# EAGLE design DummyLoad (EAGLE 8.6.3)
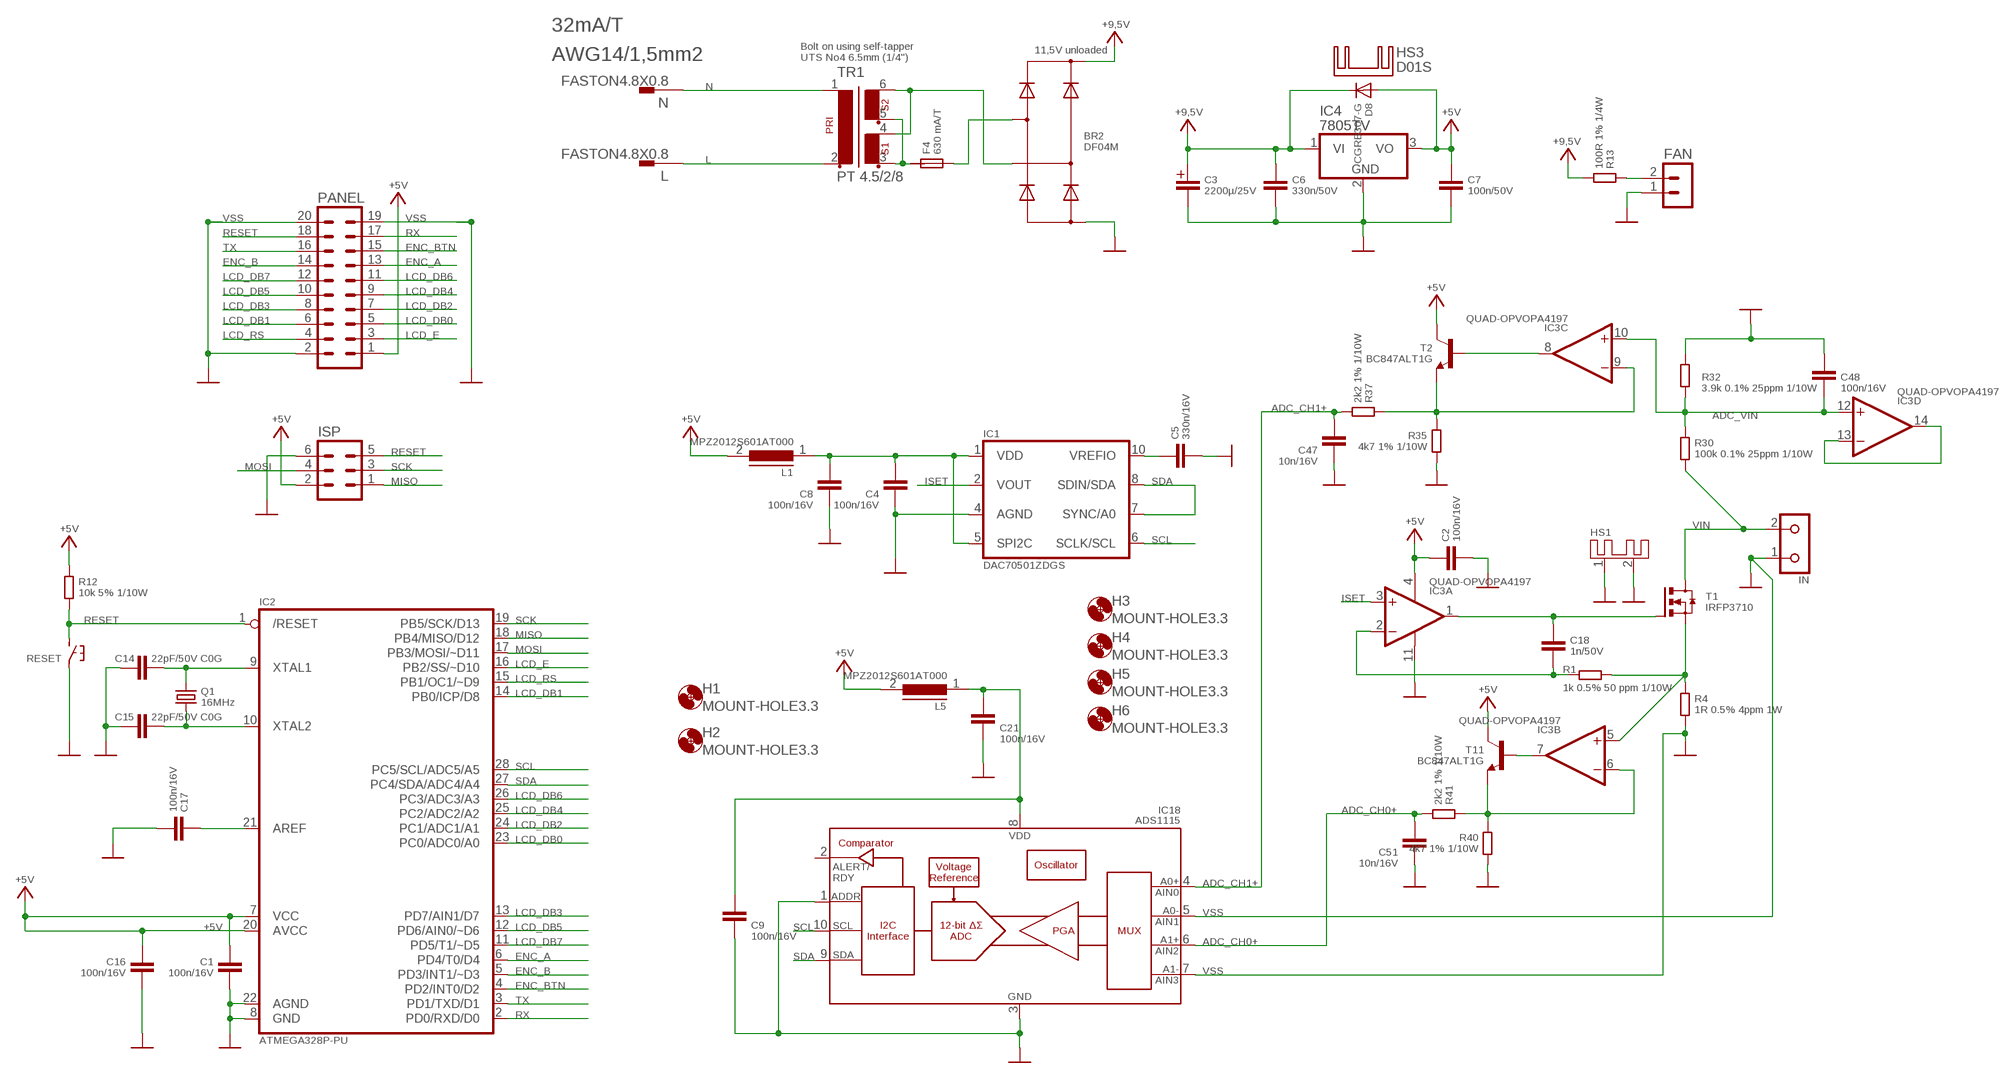
[diagram p0: schematic, sheet 1]

## Parts
BR2  DF04M  BRDIL2  [BR-DIL2]
C1  100n/16V  CC/0805  [0805]
C2  100n/16V  CC/0805  [0805]
C3  2200µ/25V  C+5/12.5  [C+/5/12.5]
C4  100n/16V  CC/0805  [0805]
C5  330n/16V  CC/0805  [0805]
C6  330n/50V  CC/0805  [0805]
C7  100n/50V  CC/0805  [0805]
C8  100n/16V  CC/0805  [0805]
C9  100n/16V  CC/0805  [0805]
C14  22pF/50V C0G  CC/0805  [0805]
C15  22pF/50V C0G  CC/0805  [0805]
C16  100n/16V  CC/0805  [0805]
C17  100n/16V  CC/0805  [0805]
C18  1n/50V  CC/0805  [0805]
C21  100n/16V  CC/0805  [0805]
C47  10n/16V  CC/0805  [0805]
C48  100n/16V  CC/0805  [0805]
C51  10n/16V  CC/0805  [0805]
D8  CGRB307-G  DWIDE  [DO214AA-CGRB307-G]
F4  630 mA/T  F5X20  [F5X20]
FAN  JST-PH-2.0-2P  [JST-PH-2.0-2P]
H1  MOUNT-HOLE3.3  [3,3]
H2  MOUNT-HOLE3.3  [3,3]
H3  MOUNT-HOLE3.3  [3,3]
H4  MOUNT-HOLE3.3  [3,3]
H5  MOUNT-HOLE3.3  [3,3]
H6  MOUNT-HOLE3.3  [3,3]
HS1  HSCR201-50  [CR201-50]
HS3  D01S  [D01S]
IC1  DAC70501ZDGS  DAC70501  [VSSOP10]
IC2  ATMEGA328P-PU  [DIL28]
IC3  QUAD-OPVOPA4197  [SO14]
IC4  7805TV  [TO220V]
IC18  ADS1115  ADS1015VSSOP10  [VSSOP10]
IN  KL2691311500002  [KL2-691311500002]
ISP  ML6  [ML6]
L  FASTON4.8X0.8  [FASTON-4.8X0.8]
L1  MPZ2012S601AT000  L0805  [C0805K]
L5  MPZ2012S601AT000  L0805  [C0805K]
N  FASTON4.8X0.8  [FASTON-4.8X0.8]
PANEL  MA10-2  [MA10-2]
Q1  16MHz  Q5X3.2MM-TXC-7A-SERIES  [Q-5X3.2MM-TXC-7A.SERIES]
R1  1k 0.5% 50 ppm 1/10W  R-SMD0805  [C0805K]
R4  1R 0.5% 4ppm 1W  R-SHUNTVSR  [R-SHUNT-VSR]
R12  10k 5% 1/10W  R-SMD0805  [C0805K]
R13  100R 1% 1/4W  R-SMD0805  [C0805K]
R30  100k 0.1% 25ppm 1/10W  R-SMD0805  [C0805K]
R32  3.9k 0.1% 25ppm 1/10W  R-SMD0805  [C0805K]
R35  4k7 1% 1/10W  R-SMD0805  [C0805K]
R37  2k2 1% 1/10W  R-SMD0805  [C0805K]
R40  4k7 1% 1/10W  R-SMD0805  [C0805K]
R41  2k2 1% 1/10W  R-SMD0805  [C0805K]
RESET  TS1B3F-10XX  [B3F-10XX]
T1  IRFP3710  T-NMOSTO247  [TOP3AV]
T2  BC847ALT1G  T-NPNSOT23-BEC  [SOT23-BEC]
T11  BC847ALT1G  T-NPNSOT23-BEC  [SOT23-BEC]
TR1  PT 4.5/2/8  PT4,5/2/..  [PT/4,5/2/..]

## Nets
+5V: C1.1 C2.1 C7.1 C16.1 D8.A IC2.7(VCC) IC2.20(AVCC) IC3.4(PWR:V+) IC4.3(VO) ISP.2 L1.2 L5.2 PANEL.1 R12.1 T2.C T11.C
+9,5V: BR2.DC+ C3.+ C6.1 D8.C IC4.1(VI) R13.2
ADC_CH0+: C51.1 IC18.6(AIN2) R41.2
ADC_CH1+: C47.1 IC18.4(AIN0) R37.2
ADC_VIN: C48.2 IC3.10(C:+IN) IC3.12(D:+IN) R30.1 R32.2
ENC_A: IC2.6(PD4/T0/D4) PANEL.13
ENC_B: IC2.5(PD3/INT1/~D3) PANEL.14
ENC_BTN: IC2.4(PD2/INT0/D2) PANEL.15
ISET: IC1.2(VOUT) IC3.3(A:+IN)
L: L.A1 L.A2 TR1.2
LCD_DB0: IC2.23(PC0/ADC0/A0) PANEL.5
LCD_DB1: IC2.14(PB0/ICP/D8) PANEL.6
LCD_DB2: IC2.24(PC1/ADC1/A1) PANEL.7
LCD_DB3: IC2.13(PD7/AIN1/D7) PANEL.8
LCD_DB4: IC2.25(PC2/ADC2/A2) PANEL.9
LCD_DB5: IC2.12(PD6/AIN0/~D6) PANEL.10
LCD_DB6: IC2.26(PC3/ADC3/A3) PANEL.11
LCD_DB7: IC2.11(PD5/T1/~D5) PANEL.12
LCD_E: IC2.16(PB2/SS/~D10) PANEL.3
LCD_RS: IC2.15(PB1/OC1/~D9) PANEL.4
MISO: IC2.18(PB4/MISO/D12) ISP.1
MOSI: IC2.17(PB3/MOSI/~D11) ISP.4
N: N.A1 N.A2 TR1.1
N$1: C18.1 IC3.1(A:OUT) T1.B(G)
N$2: IC3.7(B:OUT) T11.B
N$3: C17.1 IC2.21(AREF)
N$4: C18.2 IC3.2(A:-IN) R1.2
N$5: IC3.5(B:+IN) R1.1 R4.1 T1.E(S)
N$6: C9.1 C21.1 IC18.8(VDD) L5.1
N$7: C5.1 IC1.10(VREFIO)
N$8: IC3.8(C:OUT) T2.B
N$9: IC3.13(D:-IN) IC3.14(D:OUT)
N$14: C14.2 IC2.9(XTAL1) Q1.2
N$15: C15.2 IC2.10(XTAL2) Q1.1
N$27: BR2.AC1 F4.3 F4.4
N$33: F4.1 F4.2 TR1.3 TR1.5
N$34: BR2.AC2 TR1.4 TR1.6
N$35: FAN.2 R13.1
N$41: IC3.9(C:-IN) R35.1 R37.1 T2.E
N$45: IC3.6(B:-IN) R40.1 R41.1 T11.E
RESET: IC2.1(/RESET) ISP.5 PANEL.18 R12.2 RESET.3
RX: IC2.2(PD0/RXD/D0) PANEL.17
SCK: IC2.19(PB5/SCK/D13) ISP.3
SCL: IC1.6(SCLK/SCL) IC2.28(PC5/SCL/ADC5/A5) IC18.10(SCL)
SDA: IC1.7(SYNC/A0) IC1.8(SDIN/SDA) IC2.27(PC4/SDA/ADC4/A4) IC18.9(SDA)
TX: IC2.3(PD1/TXD/D1) PANEL.16
VDD: C4.1 C8.1 IC1.1(VDD) IC1.5(SPI2C) L1.1
VIN: IN.2 R30.2 T1.C(D)
VSS: BR2.DC- C1.2 C2.2 C3.- C4.2 C5.2 C6.2 C7.2 C8.2 C9.2 C14.1 C15.1 C16.2 C17.2 C21.2 C47.2 C48.1 C51.2 FAN.1 HS1.1 HS1.2 IC1.4(AGND) IC2.8(GND) IC2.22(AGND) IC3.11(PWR:V-) IC4.2(GND) IC18.1(ADDR) IC18.3(VSS) IC18.5(AIN1) IC18.7(AIN3) IN.1 ISP.6 PANEL.2 PANEL.19 PANEL.20 R4.2 R32.1 R35.2 R40.2 RESET.1
Unconnected: IC18.2(ALERT/RDY)

## Notes on the sheet
- 32mA/T
- 11,5V unloaded
- AWG14/1,5mm2
- Bolt on using self-tapper
  UTS No4 6.5mm (1/4")

## Library data of the parts
BR2 = goujine:BR; OC_MOUSER: 621-DF04M; OC_MOUSER_ALT: 512-DF04M
C1 C2 C4 C7-C9 C16 C17 C21 C48 = goujine:C: Kondensator; OC_MOUSER: 810-C2012X7R2A104K
C3 = neumluc:C+; OC_MOUSER: 667-EEU-FS1E222
C5 C6 = goujine:C: Kondensator; OC_MOUSER: 80-C0805C334K5RECTU
C14 C15 = goujine:C: Kondensator; OC_MOUSER: 603-CC805JRNPO9BN220
C18 = goujine:C: Kondensator; OC_MOUSER: 603-CC805KRX7R0BB102
C47 C51 = goujine:C: Kondensator; OC_MOUSER: 80-C0805C103K1R
D8 = neumluc:D; OC_MOUSER: 750-CGRB307-G
F4 = goujine:F: Sicherung; OC_MOUSER: 693-0751.0110
FAN = neumluc:JST-PH-2.0-2P: PIN HEADER; OC_DIGIKEY: 455-1704-ND; OC_MOUSER_ADD: 369-MF60251V21UA99
H1-H6 = holes:MOUNT-HOLE: MOUNTING HOLE with drill center marker
HS1 = neumluc:HS; OC_MOUSER: 588-CR201-50VE
HS3 = heatsink:D01S: HEATSINK distributor Schukat; OC_MOUSER: 532-576802B00
IC1 = neumluc:DAC70501; OC_MOUSER: 595-DAC70501ZDGS
IC2 = goujine:ATMEGA328P-PU: ATMEGA328P-PU Arduino UNO R3; OC_MOUSER: 556-ATMEGA328P-PU
IC3 = neumluc:QUAD-OPV; OC_MOUSER: 595-OPA4197IDR
IC4 = linear:78*: Positive VOLTAGE REGULATOR Source: http://cache.national.com/ds/LM/LM78L05.pdf http://www.fairchildsemi.com/ds/LM/LM7805.pdf; OC_MOUSER: 511-L7805CV
IC18 = neumluc:ADS1015: ADS1015 12-BIT ADC 12-Bit Del-Sig ADC Four single-ended inputs or two differential inputs Internal PGA I2C interface 2.0-5.5V SparkFun Products SparkFun Block for Intel Edison - ADC <https://www.sparkfun.com/products/13770> (DEV-13770); OC_MOUSER: 595-ADS1115IDGSR
IN = neumluc:KL2: Printklemme 2-polig; OC_MOUSER: 710-691311500002; OC_MOUSER_ADD: 565-72912-2; OC_MOUSER_ADD2: 565-6883
ISP = neumluc:ML6: HARTING; OC_FARNELL: unknown; OC_MOUSER: 200-TSW10307TD; OC_NEWARK: unknown
L N = neumluc:FASTON: Flachstecker Typ Tyco/Electronics/AMP TAB, FASTON Printed Circuit Board Tabs Source: http://www.buerklin.com, http://catalog.tycoelectronics.com; OC_CONRAD: 736079; OC_CONRAD_ADD: 1022092; OC_FARNELL: unknown; OC_NEWARK: unknown
L1 L5 = neumluc:L: High Power Density, High Efficiency, Shielded Inductors; OC_MOUSER: 810-MPZ2012S601AT000
PANEL = con-lstb:MA10-2: PIN HEADER; OC_FARNELL: unknown; OC_MOUSER: 200-HTSW10907LMD; OC_NEWARK: unknown
Q1 = neumluc:Q; OC_MOUSER: 717-7A-16.000MAAJ-T
R1 = neumluc:R-SMD: R SMD; OC_MOUSER: 754-RR1220P-102D
R4 = neumluc:R-SHUNT; OC_MOUSER: 71-VSRT1R0000DB
R12 = neumluc:R-SMD: R SMD; OC_MOUSER: 652-CR0805-JW-103ELF
R13 = neumluc:R-SMD: R SMD; OC_MOUSER: 660-RK73H2ATTD75R0F
R30 = neumluc:R-SMD: R SMD; OC_MOUSER: 754-RG2012P-104-B-T5
R32 = neumluc:R-SMD: R SMD; OC_MOUSER: 754-RG2012P-392-BT5
R35 R40 = neumluc:R-SMD: R SMD; OC_MOUSER: 652-CR0805FX-4701ELF
R37 R41 = neumluc:R-SMD: R SMD; OC_MOUSER: 652-CR0805FX-2201ELF
RESET = neumluc:TS1; OC_MOUSER: 653-B3F-1022
T1 = neumluc:T-NMOS: Transistor N-Channel MOSFET; OC_MOUSER: 942-IRFP3710PBF
T2 T11 = neumluc:T-NPN: NPN Transistor; OC_MOUSER: 863-BC847ALT1G
TR1 = neumluc:PT4,5/2/..: TRANSFORMER 1 primary winding, 1 secondary winding, mounting holes BLOCK; OC_RS: 201-8463; OC_RS_ADD: 546-5604

## Board
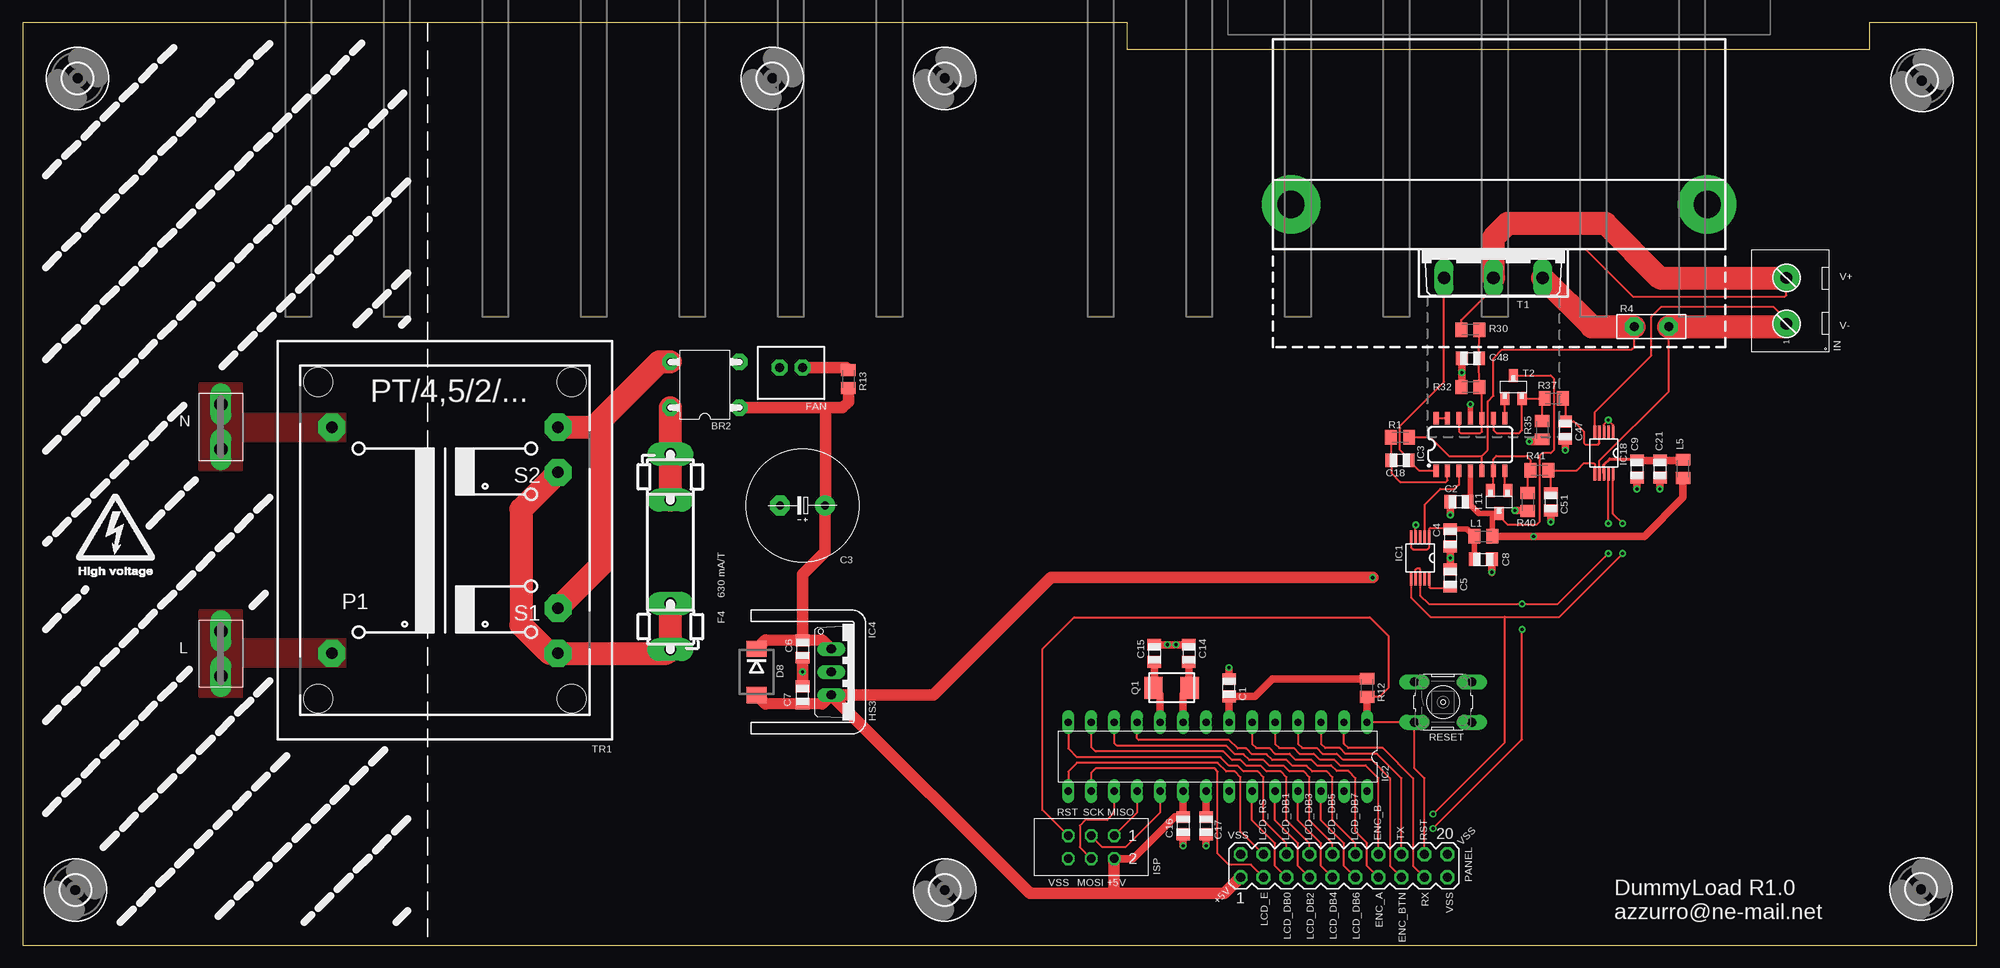
[diagram p1: board, top side]
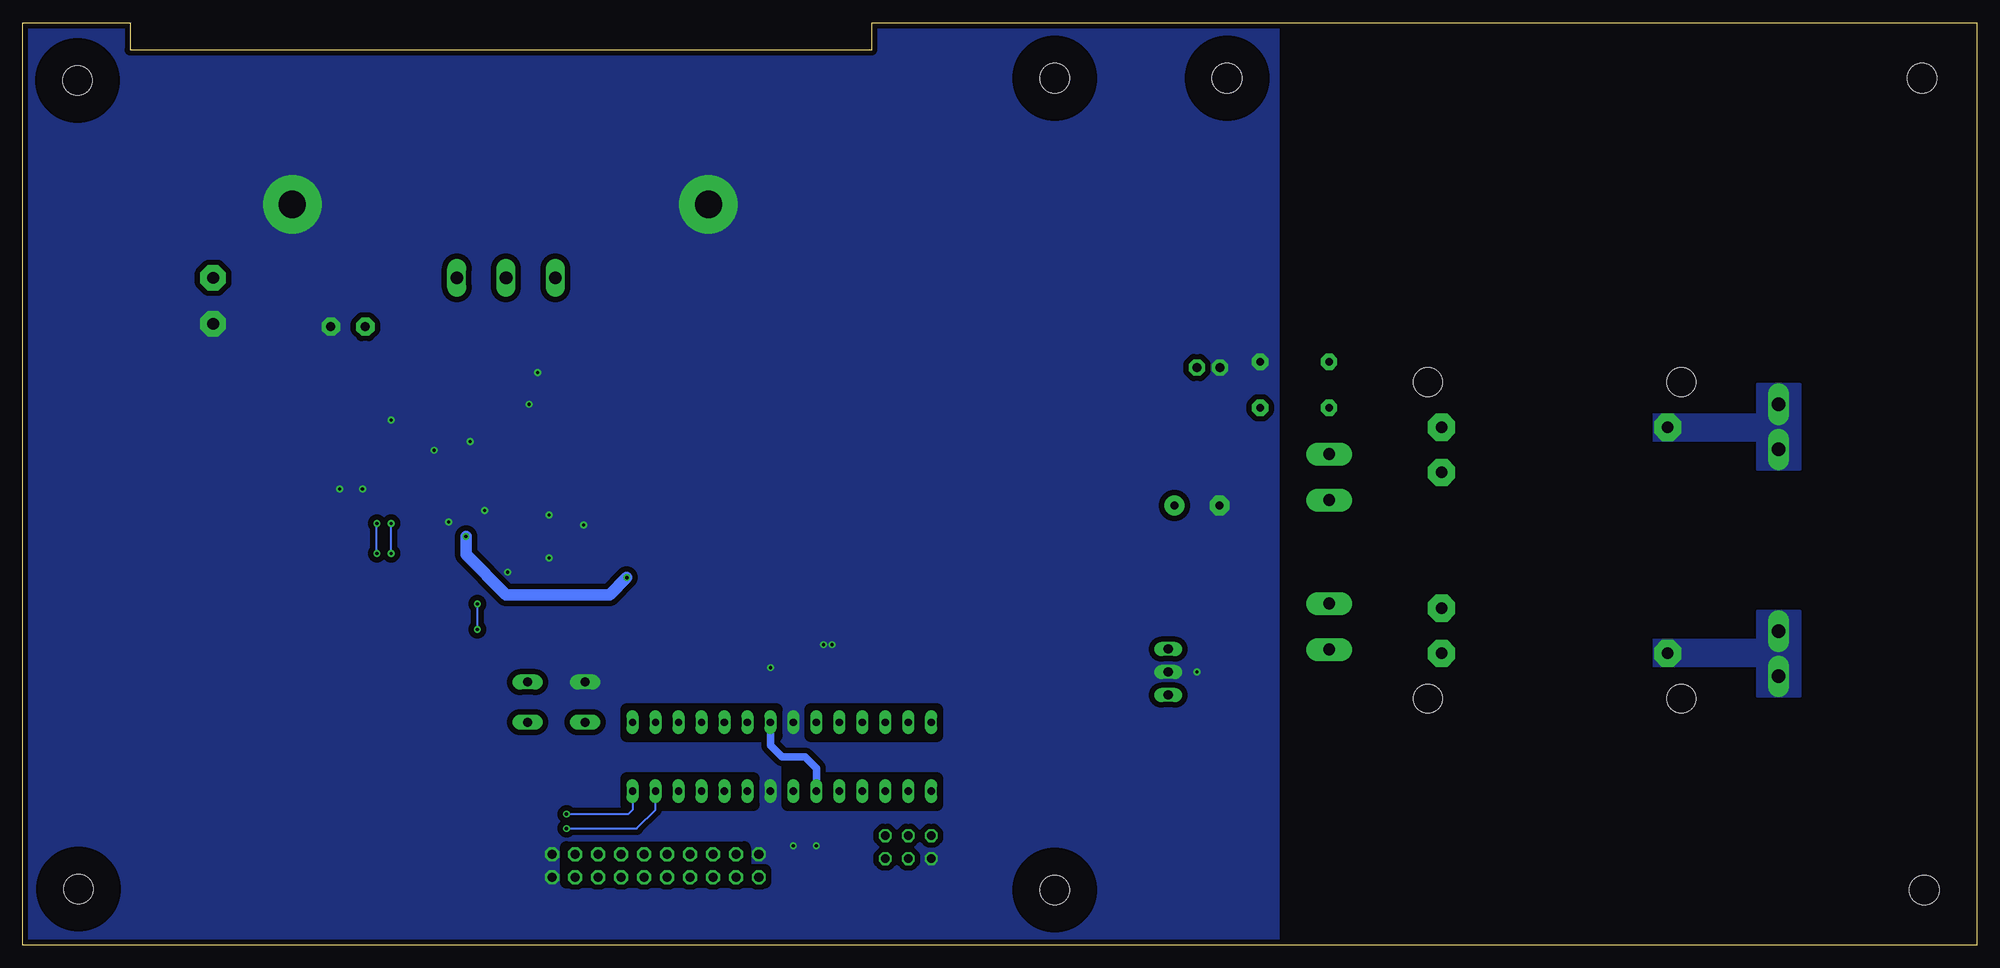
[diagram p2: board, bottom side, seen from below]

Size 216 x 102 mm. Coordinates in mm from the lower left corner, seen from the top.
Outline: 0,0 216,0 216,102 204.12,102 204.12,99 122.12,99 122.12,102 0,102 0,0
Copper layers (1*16): Top 0.035mm / dielectric 1.5mm / Bottom 0.035mm
Design rules "default": minimum track width 6mil, minimum drill 0.35mm, track to track 6mil, track to pad 6mil, pad to pad 6mil, via to via 6mil, smd to smd 6mil, copper to edge 8mil, drill to drill 6mil, minimum pad ring 10mil, minimum via ring 8mil, stop-mask expansion 4mil, vias tented up to drill 0mil, thermal gap 10mil
bRestrict: area 134,7 to 155.9,10.8; area 135.3,15.6 to 149.2,18.4; area 114.9,15.6 to 131.4,18.4; area 114.9,23.2 to 128.9,26; area 132.7,23.2 to 149.2,26; area 130.5,18.4 to 131.4,19.7

### Footprints (pad centres in the part's own frame; a part is rotated, then mirrored left to right if it is on the bottom)
BR-DIL2 = drill 0.8 pad 1.778 octagon: AC1 -2.54,3.81; AC2 2.54,3.81; DC+ -2.54,-3.81; DC- 2.54,-3.81
0805 = smd 1.3 x 1.5: 1 -0.953,0; 2 0.953,0
C+/5/12.5 = drill 0.9 pad 2.184: + -2.5,0 | drill 0.9 pad 2.184 octagon: - 2.5,0
DO214AA-CGRB307-G = smd 1.8 x 2.2: A 2.55,0; C -2.55,0
F5X20 = drill 1.3 pad 2.54 long: 1 -11.43,0; 2 -6.35,0; 3 5.08,0; 4 10.16,0
JST-PH-2.0-2P = drill 1.016 pad 1.778 octagon: 1 -1.27,0; 2 1.27,0
3,3 = hole 3.3: 0,0
CR201-50 = drill 3 pad 6.452: 1 -23,-4.95; 2 23,-4.95
VSSOP10 = smd 0.3 x 1.55: 1 -1,-2.25; 2 -0.5,-2.25; 3 0,-2.25; 4 0.5,-2.25; 5 1,-2.25; 6 1,2.25; 7 0.5,2.25; 8 0,2.25; 9 -0.5,2.25; 10 -1,2.25
DIL28 = drill 0.8 pad 1.27 long: 1 -16.51,-3.81; 2 -13.97,-3.81; 3 -11.43,-3.81; 4 -8.89,-3.81; 5 -6.35,-3.81; 6 -3.81,-3.81; 7 -1.27,-3.81; 8 1.27,-3.81; 9 3.81,-3.81; 10 6.35,-3.81; 11 8.89,-3.81; 12 11.43,-3.81; 13 13.97,-3.81; 14 16.51,-3.81; 15 16.51,3.81; 16 13.97,3.81; 17 11.43,3.81; 18 8.89,3.81; 19 6.35,3.81; 20 3.81,3.81; 21 1.27,3.81; 22 -1.27,3.81; 23 -3.81,3.81; 24 -6.35,3.81; 25 -8.89,3.81; 26 -11.43,3.81; 27 -13.97,3.81; 28 -16.51,3.81
SO14 = smd 0.6 x 1.4: 1 -3.81,-2.9; 2 -2.54,-2.9; 3 -1.27,-2.9; 4 0,-2.9; 5 1.27,-2.9; 6 2.54,-2.9; 7 3.81,-2.9; 8 3.81,2.9; 9 2.54,2.9; 10 1.27,2.9; 11 0,2.9; 12 -1.27,2.9; 13 -2.54,2.9; 14 -3.81,2.9
TO220V = drill 1.016 long: 1 -2.54,-2.54; 2 0,-2.54; 3 2.54,-2.54
KL2-691311500002 = drill 1.3 pad 2.8 octagon: 1 -2.54,0; 2 2.54,0
ML6 = drill 0.914 octagon: 1 -2.54,-1.27; 2 -2.54,1.27; 3 0,-1.27; 4 0,1.27; 5 2.54,-1.27; 6 2.54,1.27
FASTON-4.8X0.8 = drill 1.5 pad 2.3 long: A1 -2.5,0; A2 2.5,0
C0805K = smd 1.3 x 1.6: 1 -1,0; 2 1,0
MA10-2 = drill 1.016 octagon: 1 -11.43,-1.27; 2 -11.43,1.27; 3 -8.89,-1.27; 4 -8.89,1.27; 5 -6.35,-1.27; 6 -6.35,1.27; 7 -3.81,-1.27; 8 -3.81,1.27; 9 -1.27,-1.27; 10 -1.27,1.27; 11 1.27,-1.27; 12 1.27,1.27; 13 3.81,-1.27; 14 3.81,1.27; 15 6.35,-1.27; 16 6.35,1.27; 17 8.89,-1.27; 18 8.89,1.27; 19 11.43,-1.27; 20 11.43,1.27
Q-5X3.2MM-TXC-7A.SERIES = smd 2 x 2.4: 1 -2,0; 2 2,0
R-SHUNT-VSR = drill 1 pad 2 octagon: 1 -1.905,0; 2 1.905,0
B3F-10XX = drill 1 pad 1.676 long: 1 -3.175,1.905; 2 3.175,1.905; 3 -3.175,-2.54; 4 3.175,-2.54
TOP3AV = drill 1.397 long: B -5.461,-3.175; C 0,-3.175; E 5.461,-3.175
SOT23-BEC = smd 1 x 1.4: B -0.953,-1.27; C 0,1.27; E 0.953,-1.27
PT/4,5/2/.. = drill 1.27 pad 3 octagon: 1 -12.5,12.5; 2 -12.5,-12.5; 3 12.5,-12.5; 4 12.5,-7.5; 5 12.5,7.5; 6 12.5,12.5 | hole 3.2: -14,17.5; -14,-17.5; 14,-17.5; 14,17.5

### Placement (x,y rotation side)
BR2  75.41,61.96 90 top
C1  133.35,28.46 90 top
C2  158.75,49.01 180 top
C3  86.2,48.62 180 top
C4  157.8,45.04 270 top
C5  157.8,40.6 90 top
C6  86.2,32.75 270 top
C7  86.2,27.67 90 top
C8  161.45,42.66 0 top
C9  178.44,52.66 270 top
C14  128.91,32.27 270 top
C15  125.09,32.27 270 top
C16  128.27,13.22 270 top
C17  130.81,13.22 270 top
C18  152.24,53.61 180 top
C21  180.97,52.66 270 top
C47  170.5,56.95 270 top
C48  160.02,64.89 0 top
C51  168.91,49.01 270 top
D8  81.12,30.21 270 top
F4  71.6,44.13 90 top
FAN  84.93,63.86 0 top
H1  6.08,95.85 0 top
H2  5.83,6.1 0 top
H3  101.92,6.1 0 top
H4  209.82,6.2 0 top
H5  209.93,95.6 0 top
H6  101.92,95.85 0 top
H7  MOUNT-HOLE3.3  [3,3]  82.88,95.85 0 top
HS1  163.19,76.95 180 top
HS3  91.92,30.21 90 top
IC1  154.46,42.82 180 top
IC2  132.08,20.84 180 top
IC3  160.02,55.36 0 top
IC4  91.92,30.21 270 top
IC18  174.78,54.41 180 top
IN  194.94,71.23 90 top
ISP  118.11,10.84 180 top
L  21.91,32.23 90 top
L1  161.45,45.2 0 top
L5  183.51,52.66 270 top
N  21.91,57.31 90 top
PANEL  146.05,8.78 0 top
Q1  127,28.46 0 top
R1  152.24,56.15 180 top
R4  180.02,68.38 0 top
R12  148.59,28.46 270 top
R13  91.28,62.59 270 top
R30  160.02,68.06 180 top
R32  160.02,61.71 0 top
R35  167.96,56.95 270 top
R37  169.23,60.44 0 top
R40  166.37,49.01 270 top
R41  167.64,52.5 0 top
RESET  157,27.19 0 top
T1  162.56,76.95 0 top
T2  164.78,61.71 0 top
T11  163.19,49.01 180 top
TR1  46.67,44.77 0 top
U$1  [CASE-Z17]  108,26 0 top
U$2  [IEC-C14-FUSED-6200.2200]  33.34,129.18 0 top  (outside the outline)
U$3  [FAN60X25]  163.19,113.14 0 top  (outside the outline)
U$4  [SWITCH-ROCKER-1858.1103]  22.54,-77.36 180 top  (outside the outline)

### Tracks (layer width: path | path; a pad name or v marks a point on that pad's centre or on a via)
+5V  (via drill 0.35)
  Top 0.203: 160.02,49.28 C2.1 | T2.C 168.91,62.98 169.23,62.66 169.23,54.73 168.91,54.41 167.96,54.41 167.64,54.09 167.64,46.79 167.32,46.47 164.15,46.47 163.19,47.42 T11.C
  Top 0.61: IC3.4 160.02,49.28 | C2.1 160.97,47.74 162.4,47.74 | 162.4,47.74 T11.C | L1.2 162.45,47.69 162.4,47.74
  Top 0.813: IC2.7 C1.1 136.21,27.51 138.16,29.46 R12.1 | IC2.20 C16.1 127.36,14.22 122.71,9.57 ISP.2 | L1.2 v167,45.2 179.23,45.2 183.51,49.49 L5.2
  Top 1.27: D8.A 82.11,26.67 C7.1 88.38,26.67 IC4.3 | PANEL.1 132.83,5.71 120.65,5.71 | ISP.2 120.65,5.71 | IC4.3 100.69,27.67 113.67,40.64 v149.22,40.64 | IC4.3 111.33,5.71 120.65,5.71
  Bottom 0.813: IC2.7 133.35,22.11 132.08,20.84 129.54,20.84 128.27,19.57 IC2.20
  Bottom 1.27: v149.22,40.64 151.13,38.73 162.56,38.73 167,43.18 v167,45.2
+9,5V
  Top 1.27: D8.C 82.11,33.75 C6.1 | C6.1 88.38,33.75 IC4.1 | R13.2 91.28,60.05 90.65,59.42 88.74,59.42 | 88.74,59.42 88.74,48.66 C3.+ 88.7,43.5 86.2,41 C6.1 | BR2.DC+ 88.74,59.42
ADC_CH0+
  Top 0.203: C51.1 168.91,52.23 R41.2 171.77,52.5 172.56,53.3 173.67,53.3 173.78,53.19 IC18.6
ADC_CH1+
  Top 0.203: IC18.4 174.28,55.49 174.15,55.36 172.72,55.36 172.56,55.52 172.56,56.79 171.45,57.9 C47.1 170.5,60.17 R37.2
ADC_VIN
  Top 0.203: R30.1 C48.2 R32.2 161.29,61.44 IC3.10 161.29,56.79 161.13,56.63 158.91,56.63 158.75,56.79 IC3.12
ENC_A
  Top 0.203: PANEL.13 148.59,8.78 148.59,11.31 147.32,12.59 147.32,18.46 146.53,19.25 145.26,19.25 144.62,19.89 143.03,19.89 142.4,20.52 140.65,20.52 140.02,21.16 138.43,21.16 137.79,21.79 136.37,21.79 135.89,22.27 IC2.6
ENC_B
  Top 0.203: PANEL.14 149.86,18.46 148.43,19.89 145.57,19.89 144.94,20.52 143.35,20.52 142.72,21.16 141.13,21.16 140.49,21.79 138.91,21.79 138.43,22.27 IC2.5
ENC_BTN
  Top 0.203: PANEL.15 151.13,8.78 151.13,18.46 149.07,20.52 145.89,20.52 145.26,21.16 143.67,21.16 143.03,21.79 141.45,21.79 140.97,22.27 IC2.4
ISET
  Top 0.203: IC3.3 158.75,50.91 158.27,50.44 156.69,50.44 154.96,48.72 IC1.2
L
  pour Top (isolate 0.305, no thermals): 35.72,30.8 35.72,33.81 24.29,33.81 24.29,36.99 19.53,36.99 19.53,27.46 24.29,27.46 24.29,30.8
  pour Bottom (isolate 0.305, no thermals): 35.72,30.8 35.72,33.81 24.29,33.81 24.29,36.99 19.53,36.99 19.53,27.46 24.29,27.46 24.29,30.8
LCD_DB0
  Top 0.203: PANEL.5 138.43,8.78 138.43,11.27 135.89,13.81 IC2.23
LCD_DB1
  Top 0.203: PANEL.6 139.7,11.27 137.16,13.81 137.16,18.57 136.53,19.21 134.94,19.21 134.3,19.84 133.35,19.84 132.4,20.8 116.52,20.8 115.57,21.75 IC2.14
LCD_DB2
  Top 0.203: PANEL.7 140.97,8.78 140.97,11.27 138.43,13.81 IC2.24
LCD_DB3
  Top 0.203: PANEL.8 142.24,11.27 139.7,13.81 139.7,18.57 139.06,19.21 137.48,19.21 136.84,19.84 135.25,19.84 134.62,20.48 133.67,20.48 132.72,21.43 118.59,21.43 118.11,21.91 IC2.13
LCD_DB4
  Top 0.203: PANEL.9 143.51,8.78 143.51,11.27 140.97,13.81 IC2.25
LCD_DB5
  Top 0.203: PANEL.10 144.78,11.27 142.24,13.81 142.24,18.57 141.6,19.21 140.02,19.21 139.38,19.84 137.79,19.84 137.16,20.48 135.57,20.48 134.94,21.11 133.99,21.11 133.03,22.07 120.97,22.07 120.65,22.38 IC2.12
LCD_DB6
  Top 0.203: PANEL.11 146.05,8.78 146.05,11.27 143.51,13.81 IC2.26
LCD_DB7
  Top 0.203: PANEL.12 147.32,11.27 144.78,13.81 144.78,18.57 144.15,19.21 142.56,19.21 141.92,19.84 140.34,19.84 139.7,20.48 138.11,20.48 137.48,21.11 135.89,21.11 135.25,21.75 134.3,21.75 133.35,22.7 123.35,22.7 123.19,22.86 IC2.11
LCD_E
  Top 0.203: PANEL.3 135.78,8.89 133.35,8.89 132.08,10.16 132.08,19.21 131.76,19.53 118.59,19.53 118.11,19.05 IC2.16
LCD_RS
  Top 0.203: PANEL.4 134.62,12.59 134.62,18.57 133.99,19.21 133.03,19.21 132.08,20.16 116.52,20.16 115.57,19.21 IC2.15
MISO
  Top 0.203: IC2.18 123.19,14.65 ISP.1
MOSI
  Top 0.203: ISP.4 116.84,10.84 116.84,13.22 117.47,13.86 119.86,13.86 120.65,14.65 IC2.17
N
  pour Top (isolate 0.305, no thermals): 35.72,55.72 35.72,58.74 24.29,58.74 24.29,62.07 19.53,62.07 19.53,52.55 24.29,52.55 24.29,55.72
  pour Bottom (isolate 0.305, no thermals): 35.72,55.72 35.72,58.74 24.29,58.74 24.29,62.07 19.53,62.07 19.53,52.55 24.29,52.55 24.29,55.72
N$1
  Top 0.203: 156.21,52.82 IC3.1 154.35,52.46 C18.1 153.19,53.77 152.24,54.73 152.24,57.42 157.1,62.28 T1.B
N$2
  Top 0.203: T11.B 163.83,50.6 IC3.7
N$3
  Top 0.813: IC2.21 C17.1
N$4
  Top 0.203: R1.2 151.29,56.11 C18.2 151.29,52.19 152.24,51.23 157.32,51.23 157.48,51.39 IC3.2
N$5
  Top 0.203: IC3.5 161.29,54.09 | 161.29,54.09 161.93,54.73 161.93,60.12 162.56,60.76 162.56,64.89 163.51,65.84 177.8,65.84 178.12,66.16 R4.1 | 161.29,54.09 157.64,54.09 155.57,56.15 R1.1
  Top 2.54: T1.E 173.42,68.38 R4.1
N$6
  Top 0.305: IC18.8 174.78,53.14 175.42,53.77 178.28,53.77 C9.1
  Top 0.813: C9.1 C21.1 183.47,53.61 L5.1
N$7
  Top 0.203: IC1.10 155.46,39.6 155.57,39.48 157.64,39.48 C5.1
N$8
  Top 0.203: IC3.8 T2.B
N$9
  Top 0.203: IC3.14 IC3.13
N$14
  Top 0.813: IC2.9 128.27,27.73 Q1.2 128.91,28.55 C14.2
N$15
  Top 0.813: IC2.10 125.73,27.73 Q1.1 125.09,28.55 C15.2
N$27
  Top 2.54: F4.3 F4.4 BR2.AC1
N$33
  Top 2.54: F4.2 F4.1 71.16,32.27 TR1.3 58.22,32.27 55.09,35.4 55.09,48.18 TR1.5
N$34
  Top 2.54: TR1.4 63.98,42.07 63.98,57.15 63.86,57.27 | TR1.6 63.86,57.27 | BR2.AC2 70.37,64.5 63.86,57.98 63.86,57.27
N$35
  Top 1.27: FAN.2 91.01,63.86 R13.1
N$41
  Top 0.203: IC3.9 162.56,56.95 162.88,56.63 165.42,56.63 165.74,56.95 T2.E 165.76,60.46 167.93,60.46 | 167.96,60.49 167.93,60.46 | 167.93,60.46 R37.1 | R35.1 167.96,60.44 167.93,60.46
N$45
  Top 0.203: T11.E 162.56,50.6 IC3.6 162.56,53.77 162.88,54.09 166.21,54.09 166.64,53.66 R41.1 166.37,52.23 R40.1
RESET
  Top 0.203: ISP.5 112.71,14.97 112.71,32.75 116.2,36.24 148.91,36.24 150.97,34.17 150.97,28.46 149.97,27.46 R12.2 | PANEL.18 154.94,18.46 153.83,19.57 RESET.3 IC2.1
  Top 0.813: R12.2 IC2.1
RX
  Top 0.203: PANEL.17 153.67,8.78 153.67,18.46 150.34,21.79 146.53,21.79 146.05,22.27 IC2.2
SCK
  Top 0.203: ISP.3 119.38,10.84 121.92,10.84 125.73,14.65 IC2.19
SCL  (via drill 0.35)
  Top 0.203: IC1.6 153.46,38.42 155.57,36.31 163.83,36.31 | v176.85,46.63 175.78,47.69 IC18.10 | v176.85,43.3 169.86,36.31 163.83,36.31 | v155.89,14.49 163.83,22.43 163.83,36.31
  Bottom 0.203: v176.85,43.3 v176.85,46.63 | IC2.28 148.59,14.97 149.07,14.49 v155.89,14.49
SDA  (via drill 0.35)
  Top 0.203: IC1.7 153.96,41.52 154.15,41.71 154.31,41.71 154.46,41.55 IC1.8 154.46,38.69 155.42,37.74 v165.74,37.74 169.7,37.74 v175.26,43.3 | v175.26,46.63 175.26,52.23 IC18.9 | v155.89,12.9 165.74,22.75 v165.74,34.92
  Bottom 0.203: v175.26,43.3 v175.26,46.63 | v155.89,12.9 148.11,12.9 146.05,14.97 IC2.27 | v165.74,34.92 v165.74,37.74
TX
  Top 0.203: PANEL.16 152.4,18.46 149.7,21.16 146.21,21.16 145.57,21.79 143.99,21.79 143.51,22.27 IC2.3
VDD
  Top 0.203: IC1.5 153.46,43.98 153.67,43.77 155.26,43.77 155.46,43.98 IC1.1 155.46,46.04 155.57,46.15 157.64,46.15 C4.1
  Top 0.61: C4.1 159.66,45.99 L1.1 160.45,42.71 C8.1
VIN
  Top 0.203: 165.1,76.31 165.74,76.95 172.72,76.95 177.96,71.71 194.79,71.71 194.94,71.87 IN.2 | R30.2 159.02,69.12 162.56,72.66 T1.C
  Top 2.54: T1.C 162.56,78.22 164.15,79.81 174.94,79.81 180.97,73.78 IN.2
VSS  (via drill 0.35)
  Top 0.203: IC18.7 174.28,53.59 181.93,61.23 R4.2 | IC18.3 174.78,57.58 v175.26,58.06 175.78,57.53 IC18.1 | IC18.5 173.78,58.96 180.02,65.2 180.02,69.49 181.13,70.6 193.52,70.6 194.63,69.49 194.63,68.38 | IC1.4 153.96,46.45 v153.99,46.47
  Top 0.61: v160.02,59.8 IC3.11
  Top 0.813: C17.2 v130.81,11 | C16.2 v128.27,11 | v133.35,30.68 C1.2 | C14.1 v127.48,33.22 v126.52,33.22 C15.1 | C48.1 v159.07,63.3 159.07,61.76 R32.1 | v166.53,55.68 167.69,55.68 R35.2 | v170.5,54.73 C47.2 | v157.8,47.58 C2.2 | v164.94,48.06 166.32,48.06 R40.2 | v168.91,46.79 C51.2 | C4.2 v157.8,42.82 C5.2 | v162.4,41.23 C8.2 | v178.44,50.44 C9.2 | v180.97,50.44 C21.2
  Top 1.27: C7.2 v86.2,30.21 C6.2
  Top 2.54: R4.2 194.63,68.38 IN.1
  pour Bottom (isolate 0.61, no thermals): 77.17,0 216,0 216,102.01 77.17,102.01

### Text on the board
tNames: V+ | V- | 630 mA/T | RST | SCK | MISO | VSS | LCD_RS | LCD_DB1 | LCD_DB3 | LCD_DB5 | LCD_DB7 | ENC_B | TX | RST | VSS | VSS | MOSI | +5V | +5V | LCD_E | LCD_DB0 | LCD_DB2 | LCD_DB4 | LCD_DB6 | ENC_A | ENC_BTN | RX | VSS | DummyLoad R1.0 / azzurro@ne-mail.net